# Altium schematic sheet SVEC_TOP.SchDoc: Simple VME FMC Carrier
size 420 x 297 mm; CompanyName: Creotech Instruments SA; DrawnBy: G.Kasprowicz; Organization: CERN; Address1: European Organization for Nuclear Research; Address2: CH-1211 Genève 23 - Switzerland; Revision: -; SheetNumber: 1; SheetTotal: 19; EDA_Number: EDA-xxxx; Projet: Simple VME FMC Carrier; ModifiedBy: -; CreateDate: 20/11/2012; Title2: top; DivGrp: BE-CO; Designer: G.Kasprowicz; PageSetup: Record=PageOptions|CenterHorizontal=True|CenterVertical=True|PrintScale=0.95|XCorrection=1.00|YCorrection=1.00|PrintKind=1|BorderSize=5000000|LeftOffset=0|BottomOffset=0|Orientation=2|PaperLength=1000|PaperWidth=1000|Scale=100|PaperSource=15|PrintQuality=600|MediaType=1|DitherType=10|PaperKind=A3|PrintScaleMode=1; ModifiedDate: -
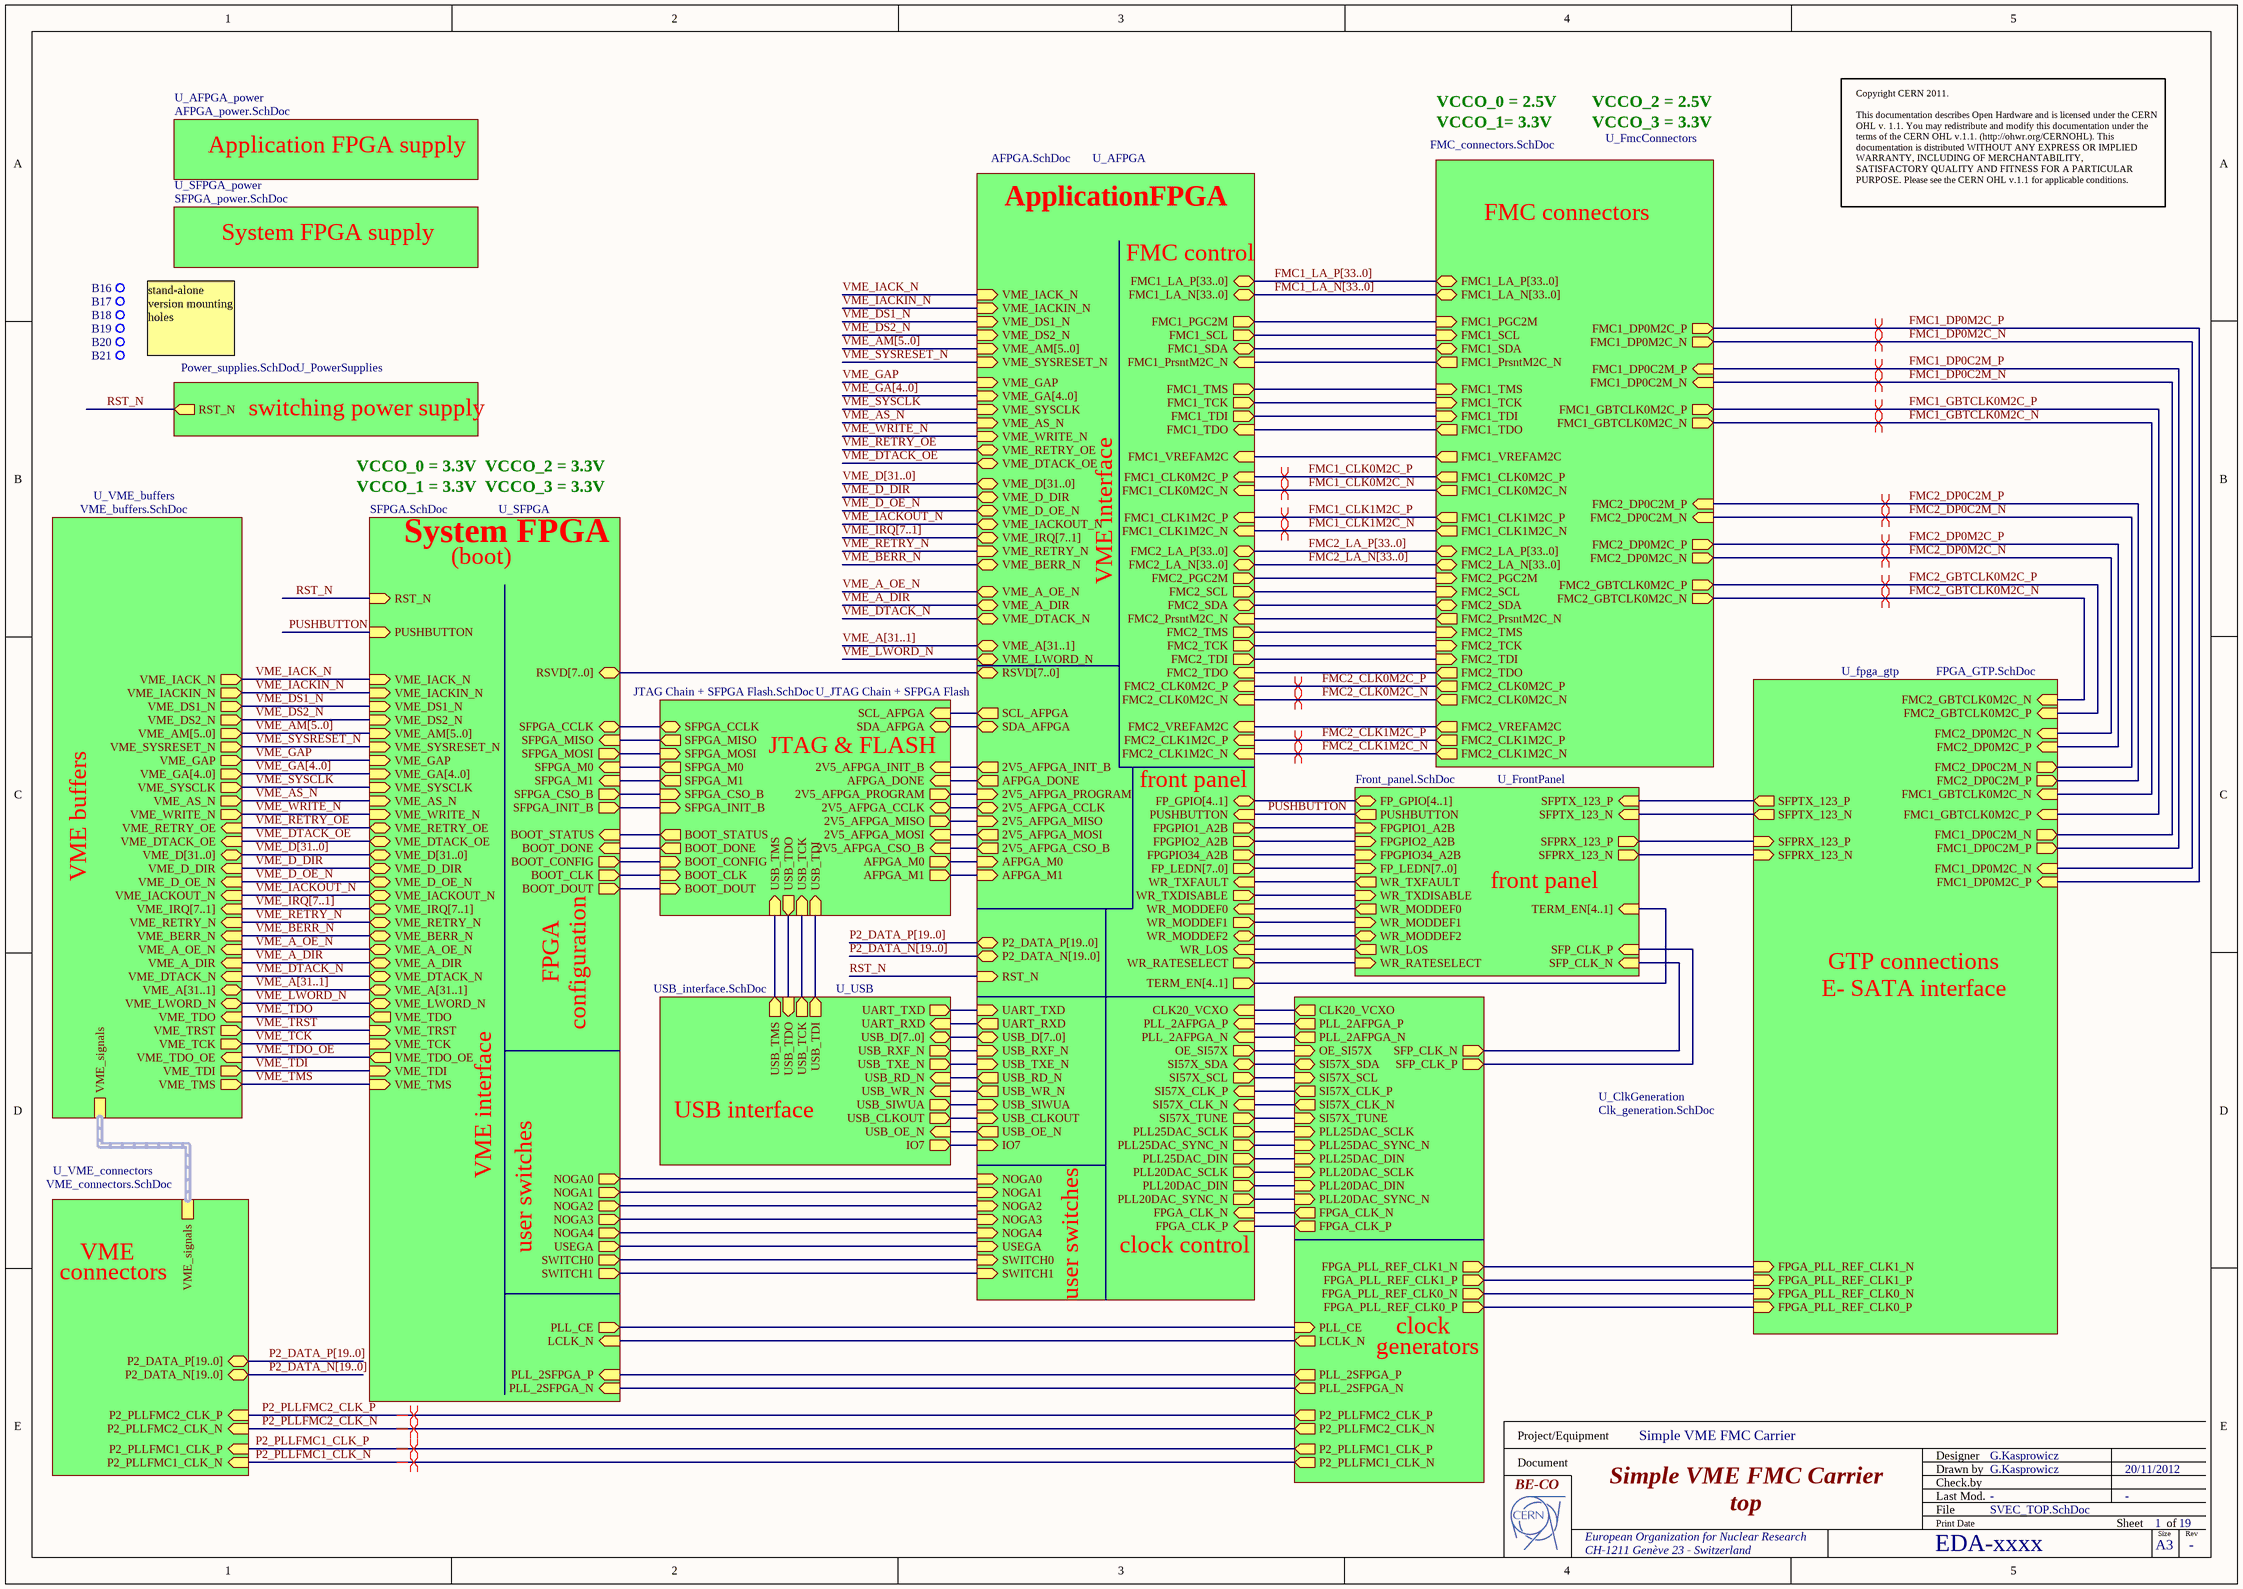
[diagram p0: SVEC_TOP.SchDoc]

## Parts
B16  Plated Hole  [MTG350_650]  (value not drawn)
B17  Plated Hole  [MTG350_650]  (value not drawn)
B18  Plated Hole  [MTG350_650]  (value not drawn)
B19  Plated Hole  [MTG350_650]  (value not drawn)
B20  Plated Hole  [MTG350_650]  (value not drawn)
B21  Plated Hole  [MTG350_650]  (value not drawn)

## Sub-sheets
U_AFPGA = AFPGA.SchDoc: RSVD[7..0] (bidir), PUSHBUTTON (in), WR_TXFAULT (in), WR_TXDISABLE (out), WR_MODDEF0 (in), WR_MODDEF1 (out), WR_MODDEF2 (bidir), WR_LOS (in), WR_RATESELECT (out), FP_LEDN[7..0] (out), FPGPIO1_A2B (out), FPGPIO2_A2B (out), FPGPIO34_A2B (out), FP_GPIO[4..1] (bidir), PLL_2AFPGA_P (in), PLL_2AFPGA_N (in), SI57X_SDA (bidir), SI57X_CLK_P (in), SI57X_CLK_N (in), SI57X_SCL (out), OE_SI57X (out), SI57X_TUNE (out), PLL25DAC_SCLK (out), PLL25DAC_DIN (out), CLK20_VCXO (in), FPGA_CLK_P (in), FPGA_CLK_N (in), TERM_EN[4..1] (out), PLL25DAC_SYNC_N (out), PLL20DAC_SCLK (out), PLL20DAC_DIN (out), PLL20DAC_SYNC_N (out), NOGA0 (in), NOGA1 (in), NOGA2 (in), NOGA3 (in), NOGA4 (in), USEGA (in), SWITCH0 (in), SWITCH1 (in), UART_TXD (in), UART_RXD (out), USB_D[7..0] (bidir), USB_RXF_N (in), USB_TXE_N (in), USB_RD_N (out), USB_WR_N (out), USB_SIWUA (in), USB_CLKOUT (in), USB_OE_N (out), IO7 (in), RST_N (in), P2_DATA_P[19..0] (bidir), P2_DATA_N[19..0] (bidir), AFPGA_DONE (out), AFPGA_M0 (in), AFPGA_M1 (in), 2V5_AFPGA_CCLK (bidir), 2V5_AFPGA_MISO (in), 2V5_AFPGA_INIT_B (out), 2V5_AFPGA_MOSI (out), 2V5_AFPGA_CSO_B (out), 2V5_AFPGA_PROGRAM (in), SDA_AFPGA (bidir), SCL_AFPGA (out), VME_IACK_N (in), VME_IACKIN_N (in), VME_SYSRESET_N (in), VME_AM[5..0] (in), VME_DS1_N (in), VME_DS2_N (in), VME_D_DIR (bidir), VME_D_OE_N (bidir), VME_IACKOUT_N (bidir), VME_RETRY_N (in), VME_BERR_N (bidir), VME_A_OE_N (bidir), VME_A_DIR (bidir), VME_DTACK_N (bidir), VME_LWORD_N (bidir), VME_A[31..1] (bidir), VME_IRQ[7..1] (bidir), VME_D[31..0] (bidir), VME_RETRY_OE (bidir), VME_DTACK_OE (bidir), VME_SYSCLK (in), VME_AS_N (in), VME_WRITE_N (in), VME_GAP (in), VME_GA[4..0] (in), FMC2_CLK1M2C_P (in), FMC2_CLK1M2C_N (in), FMC2_CLK0M2C_P (in), FMC2_CLK0M2C_N (in), FMC2_VREFAM2C (in), FMC2_LA_P[33..0] (bidir), FMC2_LA_N[33..0] (bidir), FMC2_PGC2M (out), FMC2_SCL (out), FMC2_SDA (bidir), FMC2_PrsntM2C_N (in), FMC2_TMS (out), FMC2_TCK (out), FMC2_TDI (out), FMC2_TDO (in), FMC1_CLK0M2C_P (in), FMC1_CLK0M2C_N (in), FMC1_CLK1M2C_P (in), FMC1_CLK1M2C_N (in), FMC1_VREFAM2C (in), FMC1_LA_P[33..0] (bidir), FMC1_LA_N[33..0] (bidir), FMC1_PGC2M (out), FMC1_SCL (out), FMC1_SDA (bidir), FMC1_PrsntM2C_N (in), FMC1_TMS (out), FMC1_TCK (out), FMC1_TDI (out), FMC1_TDO (in)
U_AFPGA_power = AFPGA_power.SchDoc: no entries
U_ClkGeneration = Clk_generation.SchDoc: SFP_CLK_P (out), SFP_CLK_N (out), LCLK_N (out), PLL_2AFPGA_P (out), PLL_2AFPGA_N (out), SI57X_CLK_P (out), SI57X_CLK_N (out), SI57X_SDA (bidir), SI57X_SCL (in), CLK20_VCXO (out), SI57X_TUNE (in), PLL25DAC_SCLK (in), PLL25DAC_DIN (in), OE_SI57X (in), FPGA_CLK_P (out), FPGA_CLK_N (out), P2_PLLFMC2_CLK_N (out), P2_PLLFMC2_CLK_P (out), PLL_2SFPGA_P (out), PLL_2SFPGA_N (out), P2_PLLFMC1_CLK_P (out), P2_PLLFMC1_CLK_N (out), PLL_CE (in), PLL20DAC_SCLK (in), PLL25DAC_SYNC_N (in), PLL20DAC_DIN (in), PLL20DAC_SYNC_N (in), FPGA_PLL_REF_CLK1_N (out), FPGA_PLL_REF_CLK1_P (out), FPGA_PLL_REF_CLK0_N (out), FPGA_PLL_REF_CLK0_P (out)
U_FmcConnectors = FMC_connectors.SchDoc: FMC2_CLK1M2C_P (out), FMC2_CLK1M2C_N (out), FMC2_VREFAM2C (out), FMC2_CLK0M2C_P (out), FMC2_CLK0M2C_N (out), FMC2_LA_P[33..0] (bidir), FMC2_LA_N[33..0] (bidir), FMC2_PrsntM2C_N (out), FMC2_PGC2M (in), FMC2_SCL (in), FMC2_SDA (bidir), FMC2_TMS (in), FMC2_TCK (in), FMC2_TDI (in), FMC2_TDO (out), FMC1_CLK0M2C_P (out), FMC1_CLK0M2C_N (out), FMC1_CLK1M2C_P (out), FMC1_CLK1M2C_N (out), FMC1_LA_P[33..0] (bidir), FMC1_LA_N[33..0] (bidir), FMC1_PGC2M (in), FMC1_SCL (in), FMC1_SDA (bidir), FMC1_PrsntM2C_N (out), FMC1_VREFAM2C (out), FMC1_TMS (in), FMC1_TCK (in), FMC1_TDI (in), FMC1_TDO (out), FMC2_DP0C2M_P (in), FMC2_DP0C2M_N (in), FMC2_DP0M2C_P (out), FMC2_DP0M2C_N (out), FMC2_GBTCLK0M2C_P (out), FMC2_GBTCLK0M2C_N (out), FMC1_GBTCLK0M2C_P (out), FMC1_GBTCLK0M2C_N (out), FMC1_DP0C2M_P (in), FMC1_DP0C2M_N (in), FMC1_DP0M2C_P (out), FMC1_DP0M2C_N (out)
U_fpga_gtp = FPGA_GTP.SchDoc: FPGA_PLL_REF_CLK1_N (in), FPGA_PLL_REF_CLK1_P (in), FPGA_PLL_REF_CLK0_N (in), FPGA_PLL_REF_CLK0_P (in), SFPRX_123_N (in), SFPRX_123_P (in), SFPTX_123_N (out), SFPTX_123_P (out), FMC2_GBTCLK0M2C_N (in), FMC2_GBTCLK0M2C_P (in), FMC2_DP0M2C_N (in), FMC2_DP0M2C_P (in), FMC2_DP0C2M_N (out), FMC2_DP0C2M_P (out), FMC1_GBTCLK0M2C_N (in), FMC1_GBTCLK0M2C_P (in), FMC1_DP0C2M_N (out), FMC1_DP0C2M_P (out), FMC1_DP0M2C_N (in), FMC1_DP0M2C_P (in)
U_FrontPanel = Front_panel.SchDoc: WR_TXFAULT (out), WR_TXDISABLE (in), WR_MODDEF0 (out), WR_MODDEF1 (in), WR_MODDEF2 (bidir), WR_RATESELECT (in), WR_LOS (out), PUSHBUTTON (out), SFP_CLK_P (in), SFP_CLK_N (in), SFPTX_123_P (in), SFPTX_123_N (in), SFPRX_123_P (out), SFPRX_123_N (out), FP_LEDN[7..0] (in), FPGPIO1_A2B (in), FPGPIO2_A2B (in), FPGPIO34_A2B (in), FP_GPIO[4..1] (bidir), TERM_EN[4..1] (in)
U_JTAG Chain + SFPGA Flash = JTAG Chain + SFPGA Flash.SchDoc: AFPGA_M0 (out), AFPGA_M1 (out), AFPGA_DONE (in), 2V5_AFPGA_CCLK (bidir), 2V5_AFPGA_MISO (out), 2V5_AFPGA_INIT_B (in), 2V5_AFPGA_MOSI (in), 2V5_AFPGA_CSO_B (in), 2V5_AFPGA_PROGRAM (out), SDA_AFPGA (bidir), SCL_AFPGA (in), BOOT_STATUS (out), BOOT_DONE (out), BOOT_CONFIG (in), BOOT_CLK (in), BOOT_DOUT (in), SFPGA_CCLK (bidir), SFPGA_MISO (out), SFPGA_MOSI (in), SFPGA_M0 (out), SFPGA_M1 (out), SFPGA_CSO_B (in), SFPGA_INIT_B (in), USB_TDI (in), USB_TCK (in), USB_TDO (out), USB_TMS (in)
U_PowerSupplies = Power_supplies.SchDoc: RST_N (out)
U_SFPGA = SFPGA.SchDoc: RSVD[7..0] (bidir), LCLK_N (in), PUSHBUTTON (in), RST_N (in), PLL_2SFPGA_P (in), PLL_2SFPGA_N (in), PLL_CE (out), VME_TDO_OE (out), VME_TDO (out), VME_TDI (in), VME_TCK (in), VME_TRST (in), VME_TMS (in), VME_LWORD_N (bidir), VME_A[31..1] (bidir), VME_A_OE_N (bidir), VME_A_DIR (bidir), VME_DTACK_N (bidir), VME_D_DIR (bidir), VME_D_OE_N (bidir), VME_IACKOUT_N (bidir), VME_RETRY_N (bidir), VME_BERR_N (bidir), VME_IRQ[7..1] (bidir), VME_D[31..0] (bidir), VME_RETRY_OE (bidir), VME_DTACK_OE (bidir), VME_SYSCLK (in), VME_AS_N (in), VME_WRITE_N (in), VME_GAP (in), VME_GA[4..0] (in), VME_IACK_N (in), VME_IACKIN_N (in), VME_SYSRESET_N (in), VME_AM[5..0] (in), VME_DS1_N (in), VME_DS2_N (in), NOGA0 (out), NOGA1 (out), NOGA2 (out), NOGA3 (out), NOGA4 (out), USEGA (out), SWITCH0 (out), SWITCH1 (out), BOOT_STATUS (in), BOOT_DONE (in), BOOT_CONFIG (out), BOOT_CLK (out), BOOT_DOUT (out), SFPGA_CCLK (bidir), SFPGA_MISO (in), SFPGA_MOSI (out), SFPGA_M0 (in), SFPGA_M1 (in), SFPGA_CSO_B (out), SFPGA_INIT_B (out)
U_SFPGA_power = SFPGA_power.SchDoc: no entries
U_USB = USB_interface.SchDoc: UART_TXD (out), UART_RXD (in), USB_D[7..0] (bidir), USB_RXF_N (out), USB_TXE_N (out), USB_RD_N (in), USB_WR_N (in), USB_SIWUA (out), USB_CLKOUT (out), USB_OE_N (in), IO7 (out), USB_TCK (out), USB_TDI (out), USB_TDO (in), USB_TMS (out)
U_VME_buffers = VME_buffers.SchDoc: VME_signals (harness VME_signals), VME_TCK (out), VME_TRST (out), VME_TMS (out), VME_TDI (out), VME_TDO (in), VME_A[31..1] (bidir), VME_LWORD_N (bidir), VME_TDO_OE (in), VME_A_OE_N (in), VME_A_DIR (in), VME_DTACK_N (in), VME_D[31..0] (bidir), VME_D_DIR (in), VME_D_OE_N (in), VME_IACKOUT_N (in), VME_IRQ[7..1] (in), VME_RETRY_N (in), VME_BERR_N (in), VME_RETRY_OE (in), VME_DTACK_OE (in), VME_SYSCLK (out), VME_AS_N (out), VME_WRITE_N (out), VME_GAP (out), VME_GA[4..0] (out), VME_IACK_N (out), VME_IACKIN_N (out), VME_DS1_N (out), VME_DS2_N (out), VME_AM[5..0] (out), VME_SYSRESET_N (out)
U_VME_connectors = VME_connectors.SchDoc: P2_DATA_P[19..0] (bidir), P2_DATA_N[19..0] (bidir), P2_PLLFMC1_CLK_P (in), P2_PLLFMC1_CLK_N (in), P2_PLLFMC2_CLK_P (in), P2_PLLFMC2_CLK_N (in), VME_signals (harness VME_signals)

## Nets
FMC1_CLK0M2C_N: sheet U_AFPGA/FMC1_CLK0M2C_N, sheet U_FmcConnectors/FMC1_CLK0M2C_N
FMC1_CLK0M2C_P: sheet U_AFPGA/FMC1_CLK0M2C_P, sheet U_FmcConnectors/FMC1_CLK0M2C_P
FMC1_CLK1M2C_N: sheet U_AFPGA/FMC1_CLK1M2C_N, sheet U_FmcConnectors/FMC1_CLK1M2C_N
FMC1_CLK1M2C_P: sheet U_AFPGA/FMC1_CLK1M2C_P, sheet U_FmcConnectors/FMC1_CLK1M2C_P
FMC1_DP0C2M_N: sheet U_fpga_gtp/FMC1_DP0C2M_N, sheet U_FmcConnectors/FMC1_DP0C2M_N
FMC1_DP0C2M_P: sheet U_fpga_gtp/FMC1_DP0C2M_P, sheet U_FmcConnectors/FMC1_DP0C2M_P
FMC1_DP0M2C_N: sheet U_fpga_gtp/FMC1_DP0M2C_N, sheet U_FmcConnectors/FMC1_DP0M2C_N
FMC1_DP0M2C_P: sheet U_fpga_gtp/FMC1_DP0M2C_P, sheet U_FmcConnectors/FMC1_DP0M2C_P
FMC1_GBTCLK0M2C_N: sheet U_fpga_gtp/FMC1_GBTCLK0M2C_N, sheet U_FmcConnectors/FMC1_GBTCLK0M2C_N
FMC1_GBTCLK0M2C_P: sheet U_fpga_gtp/FMC1_GBTCLK0M2C_P, sheet U_FmcConnectors/FMC1_GBTCLK0M2C_P
FMC2_CLK0M2C_N: sheet U_AFPGA/FMC2_CLK0M2C_N, sheet U_FmcConnectors/FMC2_CLK0M2C_N
FMC2_CLK0M2C_P: sheet U_AFPGA/FMC2_CLK0M2C_P, sheet U_FmcConnectors/FMC2_CLK0M2C_P
FMC2_CLK1M2C_N: sheet U_AFPGA/FMC2_CLK1M2C_N, sheet U_FmcConnectors/FMC2_CLK1M2C_N
FMC2_CLK1M2C_P: sheet U_AFPGA/FMC2_CLK1M2C_P, sheet U_FmcConnectors/FMC2_CLK1M2C_P
FMC2_DP0C2M_N: sheet U_fpga_gtp/FMC2_DP0C2M_N, sheet U_FmcConnectors/FMC2_DP0C2M_N
FMC2_DP0C2M_P: sheet U_fpga_gtp/FMC2_DP0C2M_P, sheet U_FmcConnectors/FMC2_DP0C2M_P
FMC2_DP0M2C_N: sheet U_fpga_gtp/FMC2_DP0M2C_N, sheet U_FmcConnectors/FMC2_DP0M2C_N
FMC2_DP0M2C_P: sheet U_fpga_gtp/FMC2_DP0M2C_P, sheet U_FmcConnectors/FMC2_DP0M2C_P
FMC2_GBTCLK0M2C_N: sheet U_fpga_gtp/FMC2_GBTCLK0M2C_N, sheet U_FmcConnectors/FMC2_GBTCLK0M2C_N
FMC2_GBTCLK0M2C_P: sheet U_fpga_gtp/FMC2_GBTCLK0M2C_P, sheet U_FmcConnectors/FMC2_GBTCLK0M2C_P
P2_PLLFMC1_CLK_N: sheet U_ClkGeneration/P2_PLLFMC1_CLK_N, sheet U_VME_connectors/P2_PLLFMC1_CLK_N
P2_PLLFMC1_CLK_P: sheet U_ClkGeneration/P2_PLLFMC1_CLK_P, sheet U_VME_connectors/P2_PLLFMC1_CLK_P
P2_PLLFMC2_CLK_N: sheet U_ClkGeneration/P2_PLLFMC2_CLK_N, sheet U_VME_connectors/P2_PLLFMC2_CLK_N
P2_PLLFMC2_CLK_P: sheet U_ClkGeneration/P2_PLLFMC2_CLK_P, sheet U_VME_connectors/P2_PLLFMC2_CLK_P
PUSHBUTTON: sheet U_FrontPanel/PUSHBUTTON, sheet U_SFPGA/PUSHBUTTON, sheet U_AFPGA/PUSHBUTTON
RST_N: sheet U_SFPGA/RST_N, sheet U_AFPGA/RST_N, sheet U_PowerSupplies/RST_N
VME_A_DIR: sheet U_SFPGA/VME_A_DIR, sheet U_AFPGA/VME_A_DIR, sheet U_VME_buffers/VME_A_DIR
VME_A_OE_N: sheet U_SFPGA/VME_A_OE_N, sheet U_AFPGA/VME_A_OE_N, sheet U_VME_buffers/VME_A_OE_N
VME_AS_N: sheet U_SFPGA/VME_AS_N, sheet U_AFPGA/VME_AS_N, sheet U_VME_buffers/VME_AS_N
VME_BERR_N: sheet U_SFPGA/VME_BERR_N, sheet U_AFPGA/VME_BERR_N, sheet U_VME_buffers/VME_BERR_N
VME_D_DIR: sheet U_SFPGA/VME_D_DIR, sheet U_AFPGA/VME_D_DIR, sheet U_VME_buffers/VME_D_DIR
VME_D_OE_N: sheet U_SFPGA/VME_D_OE_N, sheet U_AFPGA/VME_D_OE_N, sheet U_VME_buffers/VME_D_OE_N
VME_DS1_N: sheet U_SFPGA/VME_DS1_N, sheet U_AFPGA/VME_DS1_N, sheet U_VME_buffers/VME_DS1_N
VME_DS2_N: sheet U_SFPGA/VME_DS2_N, sheet U_AFPGA/VME_DS2_N, sheet U_VME_buffers/VME_DS2_N
VME_DTACK_N: sheet U_SFPGA/VME_DTACK_N, sheet U_AFPGA/VME_DTACK_N, sheet U_VME_buffers/VME_DTACK_N
VME_DTACK_OE: sheet U_SFPGA/VME_DTACK_OE, sheet U_AFPGA/VME_DTACK_OE, sheet U_VME_buffers/VME_DTACK_OE
VME_GAP: sheet U_SFPGA/VME_GAP, sheet U_AFPGA/VME_GAP, sheet U_VME_buffers/VME_GAP
VME_IACK_N: sheet U_SFPGA/VME_IACK_N, sheet U_AFPGA/VME_IACK_N, sheet U_VME_buffers/VME_IACK_N
VME_IACKIN_N: sheet U_SFPGA/VME_IACKIN_N, sheet U_AFPGA/VME_IACKIN_N, sheet U_VME_buffers/VME_IACKIN_N
VME_IACKOUT_N: sheet U_SFPGA/VME_IACKOUT_N, sheet U_AFPGA/VME_IACKOUT_N, sheet U_VME_buffers/VME_IACKOUT_N
VME_LWORD_N: sheet U_SFPGA/VME_LWORD_N, sheet U_AFPGA/VME_LWORD_N, sheet U_VME_buffers/VME_LWORD_N
VME_RETRY_N: sheet U_SFPGA/VME_RETRY_N, sheet U_AFPGA/VME_RETRY_N, sheet U_VME_buffers/VME_RETRY_N
VME_RETRY_OE: sheet U_SFPGA/VME_RETRY_OE, sheet U_AFPGA/VME_RETRY_OE, sheet U_VME_buffers/VME_RETRY_OE
VME_SYSCLK: sheet U_SFPGA/VME_SYSCLK, sheet U_AFPGA/VME_SYSCLK, sheet U_VME_buffers/VME_SYSCLK
VME_SYSRESET_N: sheet U_SFPGA/VME_SYSRESET_N, sheet U_AFPGA/VME_SYSRESET_N, sheet U_VME_buffers/VME_SYSRESET_N
VME_TCK: sheet U_SFPGA/VME_TCK, sheet U_VME_buffers/VME_TCK
VME_TDI: sheet U_SFPGA/VME_TDI, sheet U_VME_buffers/VME_TDI
VME_TDO: sheet U_SFPGA/VME_TDO, sheet U_VME_buffers/VME_TDO
VME_TDO_OE: sheet U_SFPGA/VME_TDO_OE, sheet U_VME_buffers/VME_TDO_OE
VME_TMS: sheet U_SFPGA/VME_TMS, sheet U_VME_buffers/VME_TMS
VME_TRST: sheet U_SFPGA/VME_TRST, sheet U_VME_buffers/VME_TRST
VME_WRITE_N: sheet U_SFPGA/VME_WRITE_N, sheet U_AFPGA/VME_WRITE_N, sheet U_VME_buffers/VME_WRITE_N
(unnamed): sheet U_FrontPanel/WR_TXFAULT, sheet U_AFPGA/WR_TXFAULT
(unnamed): sheet U_FrontPanel/WR_TXDISABLE, sheet U_AFPGA/WR_TXDISABLE
(unnamed): sheet U_FrontPanel/WR_MODDEF0, sheet U_AFPGA/WR_MODDEF0
(unnamed): sheet U_FrontPanel/WR_MODDEF1, sheet U_AFPGA/WR_MODDEF1
(unnamed): sheet U_FrontPanel/WR_MODDEF2, sheet U_AFPGA/WR_MODDEF2
(unnamed): sheet U_FrontPanel/WR_RATESELECT, sheet U_AFPGA/WR_RATESELECT
(unnamed): sheet U_FrontPanel/WR_LOS, sheet U_AFPGA/WR_LOS
(unnamed): sheet U_FrontPanel/SFP_CLK_P, sheet U_ClkGeneration/SFP_CLK_P
(unnamed): sheet U_FrontPanel/SFP_CLK_N, sheet U_ClkGeneration/SFP_CLK_N
(unnamed): sheet U_FrontPanel/SFPTX_123_P, sheet U_fpga_gtp/SFPTX_123_P
(unnamed): sheet U_FrontPanel/SFPTX_123_N, sheet U_fpga_gtp/SFPTX_123_N
(unnamed): sheet U_FrontPanel/SFPRX_123_P, sheet U_fpga_gtp/SFPRX_123_P
(unnamed): sheet U_FrontPanel/SFPRX_123_N, sheet U_fpga_gtp/SFPRX_123_N
(unnamed): sheet U_FrontPanel/FPGPIO1_A2B, sheet U_AFPGA/FPGPIO1_A2B
(unnamed): sheet U_FrontPanel/FPGPIO2_A2B, sheet U_AFPGA/FPGPIO2_A2B
(unnamed): sheet U_FrontPanel/FPGPIO34_A2B, sheet U_AFPGA/FPGPIO34_A2B
(unnamed): sheet U_SFPGA/LCLK_N, sheet U_ClkGeneration/LCLK_N
(unnamed): sheet U_SFPGA/PLL_2SFPGA_P, sheet U_ClkGeneration/PLL_2SFPGA_P
(unnamed): sheet U_SFPGA/PLL_2SFPGA_N, sheet U_ClkGeneration/PLL_2SFPGA_N
(unnamed): sheet U_SFPGA/PLL_CE, sheet U_ClkGeneration/PLL_CE
(unnamed): sheet U_SFPGA/NOGA0, sheet U_AFPGA/NOGA0
(unnamed): sheet U_SFPGA/NOGA1, sheet U_AFPGA/NOGA1
(unnamed): sheet U_SFPGA/NOGA2, sheet U_AFPGA/NOGA2
(unnamed): sheet U_SFPGA/NOGA3, sheet U_AFPGA/NOGA3
(unnamed): sheet U_SFPGA/NOGA4, sheet U_AFPGA/NOGA4
(unnamed): sheet U_SFPGA/USEGA, sheet U_AFPGA/USEGA
(unnamed): sheet U_SFPGA/SWITCH0, sheet U_AFPGA/SWITCH0
(unnamed): sheet U_SFPGA/SWITCH1, sheet U_AFPGA/SWITCH1
(unnamed): sheet U_SFPGA/BOOT_STATUS, sheet U_JTAG Chain + SFPGA Flash/BOOT_STATUS
(unnamed): sheet U_SFPGA/BOOT_DONE, sheet U_JTAG Chain + SFPGA Flash/BOOT_DONE
(unnamed): sheet U_SFPGA/BOOT_CONFIG, sheet U_JTAG Chain + SFPGA Flash/BOOT_CONFIG
(unnamed): sheet U_SFPGA/BOOT_CLK, sheet U_JTAG Chain + SFPGA Flash/BOOT_CLK
(unnamed): sheet U_SFPGA/BOOT_DOUT, sheet U_JTAG Chain + SFPGA Flash/BOOT_DOUT
(unnamed): sheet U_SFPGA/SFPGA_CCLK, sheet U_JTAG Chain + SFPGA Flash/SFPGA_CCLK
(unnamed): sheet U_SFPGA/SFPGA_MISO, sheet U_JTAG Chain + SFPGA Flash/SFPGA_MISO
(unnamed): sheet U_SFPGA/SFPGA_MOSI, sheet U_JTAG Chain + SFPGA Flash/SFPGA_MOSI
(unnamed): sheet U_SFPGA/SFPGA_M0, sheet U_JTAG Chain + SFPGA Flash/SFPGA_M0
(unnamed): sheet U_SFPGA/SFPGA_M1, sheet U_JTAG Chain + SFPGA Flash/SFPGA_M1
(unnamed): sheet U_SFPGA/SFPGA_CSO_B, sheet U_JTAG Chain + SFPGA Flash/SFPGA_CSO_B
(unnamed): sheet U_SFPGA/SFPGA_INIT_B, sheet U_JTAG Chain + SFPGA Flash/SFPGA_INIT_B
(unnamed): sheet U_ClkGeneration/PLL_2AFPGA_P, sheet U_AFPGA/PLL_2AFPGA_P
(unnamed): sheet U_ClkGeneration/PLL_2AFPGA_N, sheet U_AFPGA/PLL_2AFPGA_N
(unnamed): sheet U_ClkGeneration/SI57X_CLK_P, sheet U_AFPGA/SI57X_CLK_P
(unnamed): sheet U_ClkGeneration/SI57X_CLK_N, sheet U_AFPGA/SI57X_CLK_N
(unnamed): sheet U_ClkGeneration/SI57X_SDA, sheet U_AFPGA/SI57X_SDA
(unnamed): sheet U_ClkGeneration/SI57X_SCL, sheet U_AFPGA/SI57X_SCL
(unnamed): sheet U_ClkGeneration/CLK20_VCXO, sheet U_AFPGA/CLK20_VCXO
(unnamed): sheet U_ClkGeneration/SI57X_TUNE, sheet U_AFPGA/SI57X_TUNE
(unnamed): sheet U_ClkGeneration/PLL25DAC_SCLK, sheet U_AFPGA/PLL25DAC_SCLK
(unnamed): sheet U_ClkGeneration/PLL25DAC_DIN, sheet U_AFPGA/PLL25DAC_DIN
(unnamed): sheet U_ClkGeneration/OE_SI57X, sheet U_AFPGA/OE_SI57X
(unnamed): sheet U_ClkGeneration/FPGA_CLK_P, sheet U_AFPGA/FPGA_CLK_P
(unnamed): sheet U_ClkGeneration/FPGA_CLK_N, sheet U_AFPGA/FPGA_CLK_N
(unnamed): sheet U_ClkGeneration/PLL20DAC_SCLK, sheet U_AFPGA/PLL20DAC_SCLK
(unnamed): sheet U_ClkGeneration/PLL25DAC_SYNC_N, sheet U_AFPGA/PLL25DAC_SYNC_N
(unnamed): sheet U_ClkGeneration/PLL20DAC_DIN, sheet U_AFPGA/PLL20DAC_DIN
(unnamed): sheet U_ClkGeneration/PLL20DAC_SYNC_N, sheet U_AFPGA/PLL20DAC_SYNC_N
(unnamed): sheet U_ClkGeneration/FPGA_PLL_REF_CLK1_N, sheet U_fpga_gtp/FPGA_PLL_REF_CLK1_N
(unnamed): sheet U_ClkGeneration/FPGA_PLL_REF_CLK1_P, sheet U_fpga_gtp/FPGA_PLL_REF_CLK1_P
(unnamed): sheet U_ClkGeneration/FPGA_PLL_REF_CLK0_N, sheet U_fpga_gtp/FPGA_PLL_REF_CLK0_N
(unnamed): sheet U_ClkGeneration/FPGA_PLL_REF_CLK0_P, sheet U_fpga_gtp/FPGA_PLL_REF_CLK0_P
(unnamed): sheet U_JTAG Chain + SFPGA Flash/AFPGA_M0, sheet U_AFPGA/AFPGA_M0
(unnamed): sheet U_JTAG Chain + SFPGA Flash/AFPGA_M1, sheet U_AFPGA/AFPGA_M1
(unnamed): sheet U_JTAG Chain + SFPGA Flash/AFPGA_DONE, sheet U_AFPGA/AFPGA_DONE
(unnamed): sheet U_JTAG Chain + SFPGA Flash/2V5_AFPGA_CCLK, sheet U_AFPGA/2V5_AFPGA_CCLK
(unnamed): sheet U_JTAG Chain + SFPGA Flash/2V5_AFPGA_MISO, sheet U_AFPGA/2V5_AFPGA_MISO
(unnamed): sheet U_JTAG Chain + SFPGA Flash/2V5_AFPGA_INIT_B, sheet U_AFPGA/2V5_AFPGA_INIT_B
(unnamed): sheet U_JTAG Chain + SFPGA Flash/2V5_AFPGA_MOSI, sheet U_AFPGA/2V5_AFPGA_MOSI
(unnamed): sheet U_JTAG Chain + SFPGA Flash/2V5_AFPGA_CSO_B, sheet U_AFPGA/2V5_AFPGA_CSO_B
(unnamed): sheet U_JTAG Chain + SFPGA Flash/2V5_AFPGA_PROGRAM, sheet U_AFPGA/2V5_AFPGA_PROGRAM
(unnamed): sheet U_JTAG Chain + SFPGA Flash/SDA_AFPGA, sheet U_AFPGA/SDA_AFPGA
(unnamed): sheet U_JTAG Chain + SFPGA Flash/SCL_AFPGA, sheet U_AFPGA/SCL_AFPGA
(unnamed): sheet U_JTAG Chain + SFPGA Flash/USB_TDI, sheet U_USB/USB_TDI
(unnamed): sheet U_JTAG Chain + SFPGA Flash/USB_TCK, sheet U_USB/USB_TCK
(unnamed): sheet U_JTAG Chain + SFPGA Flash/USB_TDO, sheet U_USB/USB_TDO
(unnamed): sheet U_JTAG Chain + SFPGA Flash/USB_TMS, sheet U_USB/USB_TMS
(unnamed): sheet U_USB/UART_TXD, sheet U_AFPGA/UART_TXD
(unnamed): sheet U_USB/UART_RXD, sheet U_AFPGA/UART_RXD
(unnamed): sheet U_USB/USB_RXF_N, sheet U_AFPGA/USB_RXF_N
(unnamed): sheet U_USB/USB_TXE_N, sheet U_AFPGA/USB_TXE_N
(unnamed): sheet U_USB/USB_RD_N, sheet U_AFPGA/USB_RD_N
(unnamed): sheet U_USB/USB_WR_N, sheet U_AFPGA/USB_WR_N
(unnamed): sheet U_USB/USB_SIWUA, sheet U_AFPGA/USB_SIWUA
(unnamed): sheet U_USB/USB_CLKOUT, sheet U_AFPGA/USB_CLKOUT
(unnamed): sheet U_USB/USB_OE_N, sheet U_AFPGA/USB_OE_N
(unnamed): sheet U_USB/IO7, sheet U_AFPGA/IO7
(unnamed): sheet U_AFPGA/FMC2_VREFAM2C, sheet U_FmcConnectors/FMC2_VREFAM2C
(unnamed): sheet U_AFPGA/FMC2_PGC2M, sheet U_FmcConnectors/FMC2_PGC2M
(unnamed): sheet U_AFPGA/FMC2_SCL, sheet U_FmcConnectors/FMC2_SCL
(unnamed): sheet U_AFPGA/FMC2_SDA, sheet U_FmcConnectors/FMC2_SDA
(unnamed): sheet U_AFPGA/FMC2_PrsntM2C_N, sheet U_FmcConnectors/FMC2_PrsntM2C_N
(unnamed): sheet U_AFPGA/FMC2_TMS, sheet U_FmcConnectors/FMC2_TMS
(unnamed): sheet U_AFPGA/FMC2_TCK, sheet U_FmcConnectors/FMC2_TCK
(unnamed): sheet U_AFPGA/FMC2_TDI, sheet U_FmcConnectors/FMC2_TDI
(unnamed): sheet U_AFPGA/FMC2_TDO, sheet U_FmcConnectors/FMC2_TDO
(unnamed): sheet U_AFPGA/FMC1_VREFAM2C, sheet U_FmcConnectors/FMC1_VREFAM2C
(unnamed): sheet U_AFPGA/FMC1_PGC2M, sheet U_FmcConnectors/FMC1_PGC2M
(unnamed): sheet U_AFPGA/FMC1_SCL, sheet U_FmcConnectors/FMC1_SCL
(unnamed): sheet U_AFPGA/FMC1_SDA, sheet U_FmcConnectors/FMC1_SDA
(unnamed): sheet U_AFPGA/FMC1_PrsntM2C_N, sheet U_FmcConnectors/FMC1_PrsntM2C_N
(unnamed): sheet U_AFPGA/FMC1_TMS, sheet U_FmcConnectors/FMC1_TMS
(unnamed): sheet U_AFPGA/FMC1_TCK, sheet U_FmcConnectors/FMC1_TCK
(unnamed): sheet U_AFPGA/FMC1_TDI, sheet U_FmcConnectors/FMC1_TDI
(unnamed): sheet U_AFPGA/FMC1_TDO, sheet U_FmcConnectors/FMC1_TDO

Not connected (* = marked no-connect by the designer): B16 1; B17 1; B18 1; B19 1; B20 1; B21 1

## Buses and harness runs
bus FMC1_LA_N[33..0] = sheet U_AFPGA/FMC1_LA_N[33..0] = sheet U_FmcConnectors/FMC1_LA_N[33..0]
bus FMC1_LA_P[33..0] = sheet U_AFPGA/FMC1_LA_P[33..0] = sheet U_FmcConnectors/FMC1_LA_P[33..0]
bus FMC2_LA_N[33..0] = sheet U_AFPGA/FMC2_LA_N[33..0] = sheet U_FmcConnectors/FMC2_LA_N[33..0]
bus FMC2_LA_P[33..0] = sheet U_AFPGA/FMC2_LA_P[33..0] = sheet U_FmcConnectors/FMC2_LA_P[33..0]
bus P2_DATA_N[19..0] = sheet U_AFPGA/P2_DATA_N[19..0]
bus P2_DATA_N[19..0] = sheet U_VME_connectors/P2_DATA_N[19..0]
bus P2_DATA_P[19..0] = sheet U_AFPGA/P2_DATA_P[19..0]
bus P2_DATA_P[19..0] = sheet U_VME_connectors/P2_DATA_P[19..0]
bus sheet U_AFPGA/FP_GPIO[4..1] = sheet U_FrontPanel/FP_GPIO[4..1]
bus sheet U_AFPGA/FP_LEDN[7..0] = sheet U_FrontPanel/FP_LEDN[7..0]
bus sheet U_AFPGA/RSVD[7..0] = sheet U_SFPGA/RSVD[7..0]
bus sheet U_AFPGA/TERM_EN[4..1] = sheet U_FrontPanel/TERM_EN[4..1]
bus sheet U_AFPGA/USB_D[7..0] = sheet U_USB/USB_D[7..0]
bus VME_A[31..1] = sheet U_AFPGA/VME_A[31..1]
bus VME_A[31..1] = sheet U_SFPGA/VME_A[31..1] = sheet U_VME_buffers/VME_A[31..1]
bus VME_AM[5..0] = sheet U_AFPGA/VME_AM[5..0]
bus VME_AM[5..0] = sheet U_SFPGA/VME_AM[5..0] = sheet U_VME_buffers/VME_AM[5..0]
bus VME_D[31..0] = sheet U_AFPGA/VME_D[31..0]
bus VME_D[31..0] = sheet U_SFPGA/VME_D[31..0] = sheet U_VME_buffers/VME_D[31..0]
bus VME_GA[4..0] = sheet U_AFPGA/VME_GA[4..0]
bus VME_GA[4..0] = sheet U_SFPGA/VME_GA[4..0] = sheet U_VME_buffers/VME_GA[4..0]
bus VME_IRQ[7..1] = sheet U_AFPGA/VME_IRQ[7..1]
bus VME_IRQ[7..1] = sheet U_SFPGA/VME_IRQ[7..1] = sheet U_VME_buffers/VME_IRQ[7..1]
harness sheet U_VME_buffers/VME_signals = sheet U_VME_connectors/VME_signals

## Layout directives
differential pair: FMC1_CLK0M2C_N, FMC1_CLK0M2C_P, FMC1_CLK1M2C_N, FMC1_CLK1M2C_P, FMC1_DP0C2M_N, FMC1_DP0C2M_P, FMC1_DP0M2C_N, FMC1_DP0M2C_P, FMC1_GBTCLK0M2C_N, FMC1_GBTCLK0M2C_P, FMC2_CLK0M2C_N, FMC2_CLK0M2C_P, FMC2_CLK1M2C_N, FMC2_CLK1M2C_P, FMC2_DP0C2M_N, FMC2_DP0C2M_P, FMC2_DP0M2C_N, FMC2_DP0M2C_P, FMC2_GBTCLK0M2C_N, FMC2_GBTCLK0M2C_P, P2_PLLFMC1_CLK_N, P2_PLLFMC1_CLK_P, P2_PLLFMC2_CLK_N, P2_PLLFMC2_CLK_P

## Notes on the sheet
- VCCO_0 = 2.5V
- VCCO_1= 3.3V
- VCCO_2 = 2.5V
- VCCO_3 = 3.3V
- Application FPGA supply
- System FPGA supply
- ApplicationFPGA
- FMC control
- FMC connectors
- Copyright CERN 2011.
  This documentation describes Open Hardware and is licensed under the CERN OHL v. 1.1. You may redistribute and modify this documentation under the terms of the CERN OHL v.1.1. (http://ohwr.org/CERNOHL). This documentation is distributed WITHOUT ANY EXPRESS OR IMPLIED WARRANTY, INCLUDING OF MERCHANTABILITY, SATISFACTORY QUALITY AND FITNESS FOR A PARTICULAR PURPOSE. Please see the CERN OHL v.1.1 for applicable conditions.
- stand-alone version mounting holes
- switching power supply
- VCCO_0 = 3.3V
- VCCO_1 = 3.3V
- VCCO_2 = 3.3V
- System FPGA
- (boot)
- VME interface
- JTAG & FLASH
- front panel
- VME buffers
- FPGA
- E- SATA interface
- GTP connections
- configuration
- USB interface
- VME
- user switches
- clock control
- connectors
- clock
- generators
- Project/Equipment
- Document
- Designer
- Drawn by
- Check.by
- File
- Last Mod.
- Print Date
- Sheet
- Size
- A3
- of
- Rev

## Library data of the parts
B16-B21 = PLATED_HOLE3.5_PAD6.5: Single Terminal Socket; Part Description: Plated Through Hole: Hole Dia.=3.5mm Pad Dia.=6.5mm; Mounted: No; Table: Pads; Part Number: PLATED_HOLE3.5_PAD6.5; Component Kind: Standard (No BOM); Component Type: Standard (No BOM); Pin Count: 1; Family: Plated Hole; Socket: No; SMD: No; Status: None; ComponentHeight: 0mm; Author: CERN DEM JLC; CreateDate: 2008-11-20; LatestRevisionDate: 2011-11-23; PackageDescription: Plated Through Hole: Hole Dia.=3.5mm Pad Dia.=6.5mm